# EAGLE design MA1 (EAGLE 9.4.2)
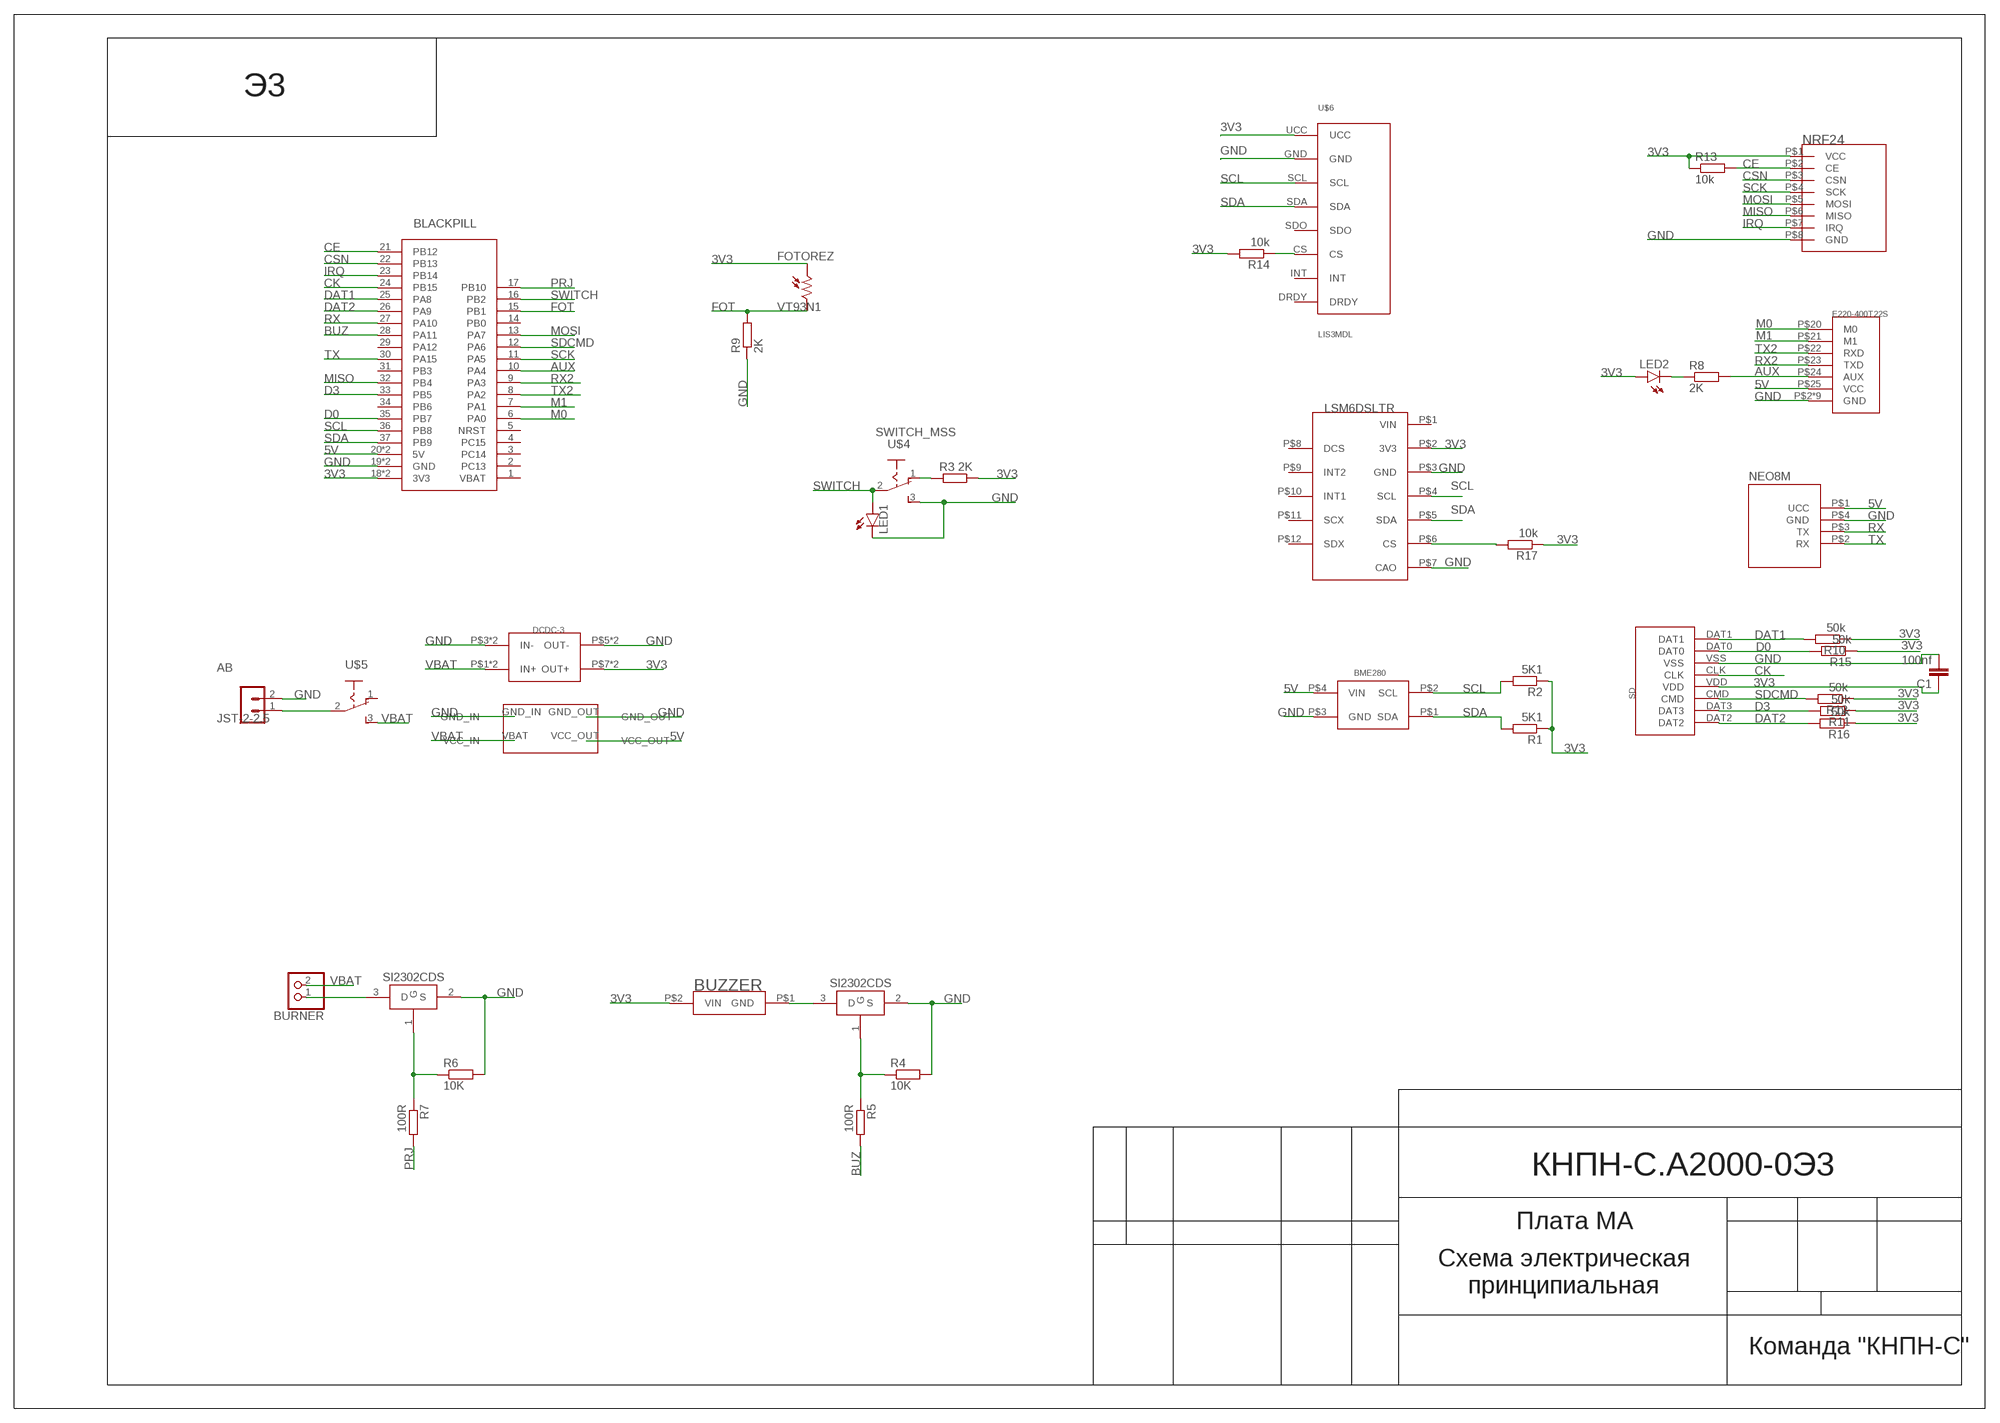
[diagram p0: schematic, sheet 1]

## Parts
AB  JST-2-2.5  [JST-2-2.5]
BLACKPILL  STM32F411_BOARD  [STM32F411_BOARD]
BME280  BME280  [BME280]
BURNER  PINHD-1X2  [1X02]
BUZZER  BUZZERS8R6  [BUZZER-S8R12]
C1  100nf  C-EUC0603  [C0603]
DCDC-3  MP1584-B  [MP1584-B]
E220-400T22S  E220-400T22S  [E220-400T22S]
FOTOREZ  VT93N1  [VT93N1]
LED1  LEDCHIP-LED0603  [CHIP-LED0603]
LED2  LEDCHIP-LED0603  [CHIP-LED0603]
LSM6DSLTR  LSM6DS3-GY  [LSM6DS3-GY]
NEO8M  GPS-NEO7M  [GPS-NEO7M]
NRF24  NRF24L01_ML01SP4  [NRF24L01_ML01SP4]
R1  5K1  R-EU_R0603  [R0603]
R2  5K1  R-EU_R0603  [R0603]
R3  2K  R-EU_R0603  [R0603]
R4  10K  R-EU_R0603  [R0603]
R5  100R  R-EU_R0603  [R0603]
R6  10K  R-EU_R0603  [R0603]
R7  100R  R-EU_R0603  [R0603]
R8  2K  R-EU_R0603  [R0603]
R9  2K  R-EU_R0603  [R0603]
R10  50k  R-EU_R0603  [R0603]
R11  50k  R-EU_R0603  [R0603]
R12  50k  R-EU_R0603  [R0603]
R13  10k  R-EU_R0603  [R0603]
R14  10k  R-EU_R0603  [R0603]
R15  50k  R-EU_R0603  [R0603]
R16  50k  R-EU_R0603  [R0603]
R17  10k  R-EU_R0603  [R0603]
SD  SD  [SD]
U$1  DS-DS_5V  [DS-DS_5V]
U$2  SI2302CDS  [SOT23-3]
U$3  SI2302CDS  [SOT23-3]
U$4  SWITCH_MSS  [SWITCH_MSS]
U$5  UNICS-SWITCHSS_12D11  [SS_12D11]
U$6  LIS3MDL  [LIS3MDL]

## Nets
3V3: BLACKPILL.18(3V3) BLACKPILL.40(3V3) BUZZER.P$2(VIN) C1.1 DCDC-3.P$7(OUT+) DCDC-3.P$8(OUT+) FOTOREZ.P$1 LED2.A LSM6DSLTR.P$2(3V3) NRF24.P$1(VCC) R1.1 R2.1 R3.1 R10.1 R11.1 R12.1 R13.1 R14.2 R15.1 R16.1 R17.1 SD.VDD U$6.UCC
5V: BLACKPILL.20(5V) BLACKPILL.38(5V) BME280.P$4(VIN) E220-400T22S.P$25(VCC) NEO8M.P$1(UCC) U$1.VCC_OUT
AUX: BLACKPILL.10(PA4) E220-400T22S.P$24(AUX) R8.2
BUZ: BLACKPILL.28(PA11) R5.2
CE: BLACKPILL.21(PB12) NRF24.P$2(CE) R13.2
CK: BLACKPILL.24(PB15) SD.CLK
CSN: BLACKPILL.22(PB13) NRF24.P$3(CSN)
D0: BLACKPILL.35(PB7) R15.2 SD.DAT0
D3: BLACKPILL.33(PB5) R11.2 SD.DAT3
DAT1: BLACKPILL.25(PA8) R10.2 SD.DAT1
DAT2: BLACKPILL.26(PA9) R16.2 SD.DAT2
FOT: BLACKPILL.15(PB1) FOTOREZ.P$2 R9.2
GND: AB.2 BLACKPILL.19(GND) BLACKPILL.39(GND) BME280.P$3(GND) C1.2 DCDC-3.P$3(IN-) DCDC-3.P$4(IN-) DCDC-3.P$5(OUT-) DCDC-3.P$6(OUT-) E220-400T22S.P$2(GND) E220-400T22S.P$8(GND) E220-400T22S.P$11(GND) E220-400T22S.P$13(GND) E220-400T22S.P$14(GND) E220-400T22S.P$15(GND) E220-400T22S.P$16(GND) E220-400T22S.P$19(GND) E220-400T22S.P$26(GND) LED1.C LSM6DSLTR.P$3(GND) LSM6DSLTR.P$7(CAO) NEO8M.P$4(GND) NRF24.P$8(GND) R4.2 R6.2 R9.1 SD.VSS U$1.GND_IN U$1.GND_OUT U$2.2(S) U$3.2(S) U$4.3(S) U$6.GND
IRQ: BLACKPILL.23(PB14) NRF24.P$7(IRQ)
M0: BLACKPILL.6(PA0) E220-400T22S.P$20(M0)
M1: BLACKPILL.7(PA1) E220-400T22S.P$21(M1)
MISO: BLACKPILL.32(PB4) NRF24.P$6(MISO)
MOSI: BLACKPILL.13(PA7) NRF24.P$5(MOSI)
N$1: BUZZER.P$1(GND) U$2.3(D)
N$2: BURNER.1 U$3.3(D)
N$3: R6.1 R7.1 U$3.1(G)
N$4: R4.1 R5.1 U$2.1(G)
N$5: AB.1 U$5.2(P)
N$6: R3.2 U$4.1(O)
N$7: LED2.C R8.1
N$8: LSM6DSLTR.P$6(CS) R17.2
N$12: R14.1 U$6.CS
PRJ: BLACKPILL.17(PB10) R7.2
RX: BLACKPILL.27(PA10) NEO8M.P$3(TX)
RX2: BLACKPILL.9(PA3) E220-400T22S.P$23(TXD)
SCK: BLACKPILL.11(PA5) NRF24.P$4(SCK)
SCL: BLACKPILL.36(PB8) BME280.P$2(SCL) LSM6DSLTR.P$4(SCL) R2.2 U$6.SCL
SDA: BLACKPILL.37(PB9) BME280.P$1(SDA) LSM6DSLTR.P$5(SDA) R1.2 U$6.SDA
SDCMD: BLACKPILL.12(PA6) R12.2 SD.CMD
SWITCH: BLACKPILL.16(PB2) LED1.A U$4.2(P)
TX: BLACKPILL.30(PA15) NEO8M.P$2(RX)
TX2: BLACKPILL.8(PA2) E220-400T22S.P$22(RXD)
VBAT: BURNER.2 DCDC-3.P$1(IN+) DCDC-3.P$2(IN+) U$1.VBAT(VCC_IN) U$5.3(S)
Unconnected: BLACKPILL.1(VBAT) BLACKPILL.2(PC13) BLACKPILL.3(PC14) BLACKPILL.4(PC15) BLACKPILL.5(NRST) BLACKPILL.14(PB0) BLACKPILL.29(PA12) BLACKPILL.31(PB3) BLACKPILL.34(PB6) LSM6DSLTR.P$1(VIN) LSM6DSLTR.P$8(DCS) LSM6DSLTR.P$9(INT2) LSM6DSLTR.P$10(INT1) LSM6DSLTR.P$11(SCX) LSM6DSLTR.P$12(SDX) U$5.1(O) U$6.DRDY U$6.INT U$6.SDO

## Notes on the sheet
- Э3
- КНПН-С.А2000-0Э3
- Плата МА
- Схема электрическая
  принципиальная
- Команда "КНПН-С"

## Library data of the parts
AB = UNKNOWN-2024:JST-2-2.5: JST PH series header 2.00mm pitch disconnectable crimp style connectors, vertical (side entry type), 2 pins
BLACKPILL = MA:STM32F411_BOARD
BME280 = MA:BME280
BURNER = pinhead:PINHD-1X2: PIN HEADER
BUZZER = MA:BUZZER
C1 = rcl:C-EU: CAPACITOR, European symbol; SPICEPREFIX: C
DCDC-3 = UNKNOWN-2024:MP1584-B
E220-400T22S = UNKNOWN-2024:E220-400T22S
FOTOREZ = UNKNOWN-2024:VT93N1
LED1 LED2 = led:LED: LED OSRAM: - CHIPLED LG R971, LG N971, LY N971, LG Q971, LY Q971, LO R971, LY R971 LH N974, LH R974 LS Q976, LO Q976, LY Q976 LO Q996 - Hyper CHIPLED LW Q18S LB Q993, LB Q99A, LB R99A - SideLED LS A670, LO A670, LY A670, LG A670, LP A670 LB A673, LV A673, LT A673, LW A673 LH A674 LY A675 LS A676, LA A676, LO A676, LY A676, LW A676 LS A679, LY A679, LG A679 - Hyper Micro SIDELED® LS Y876, LA Y876, LO Y876, LY Y876 LT Y87S - SmartLED LW L88C, LW L88S LB L89C, LB L89S, LG L890 LS L89K, LO L89K, LY L89K LS L896, LA L896, LO L896, LY L896 - TOPLED LS T670, LO T670, LY T670, LG T670, LP T670 LSG T670, LSP T670, LSY T670, LOP T670, LYG T670 LG T671, LOG T671, LSG T671 LB T673, LV T673, LT T673, LW T673 LH T674 LS T676, LA T676, LO T676, LY T676, LB T676, LH T676, LSB T676, LW T676 LB T67C, LV T67C, LT T67C, LS T67K, LO T67K, LY T67K, LW E67C LS E67B, LA E67B, LO E67B, LY E67B, LB E67C, LV E67C, LT E67C LW T67C LS T679, LY T679, LG T679 LS T770, LO T770, LY T770, LG T770, LP T770 LB T773, LV T773, LT T773, LW T773 LH T774 LS E675, LA E675, LY E675, LS T675 LS T776, LA T776, LO T776, LY T776, LB T776 LHGB T686 LT T68C, LB T68C - Hyper Mini TOPLED® LB M676 - Mini TOPLED Santana® LG M470 LS M47K, LO M47K, LY M47K Source: http://www.osram.convergy.de LUXEON: - LUMILED® LXK2-PW12-R00, LXK2-PW12-S00, LXK2-PW14-U00, LXK2-PW14-V00 LXK2-PM12-R00, LXK2-PM12-S00, LXK2-PM14-U00 LXK2-PE12-Q00, LXK2-PE12-R00, LXK2-PE12-S00, LXK2-PE14-T00, LXK2-PE14-U00 LXK2-PB12-K00, LXK2-PB12-L00, LXK2-PB12-M00, LXK2-PB14-N00, LXK2-PB14-P00, LXK2-PB14-Q00 LXK2-PR12-L00, LXK2-PR12-M00, LXK2-PR14-Q00, LXK2-PR14-R00 LXK2-PD12-Q00, LXK2-PD12-R00, LXK2-PD12-S00 LXK2-PH12-R00, LXK2-PH12-S00 LXK2-PL12-P00, LXK2-PL12-Q00, LXK2-PL12-R00 Source: www.luxeon.com KINGBRIGHT: KA-3528ASYC Source: www.kingbright.com
LSM6DSLTR = MA:LSM6DS3-GY
NEO8M = MA:GPS-NEO7M
NRF24 = UNKNOWN-2024:NRF24L01_ML01SP4
R1-R17 = rcl:R-EU_: RESISTOR, European symbol; SPICEPREFIX: R
SD = UNKNOWN-2024:SD
U$1 = MA:DS-DS_5V
U$2 U$3 = CanCubeSat:SI2302CDS
U$4 = UNKNOWN-2024:SWITCH_MSS
U$5 = UNKNOWN-2024:UNICS-SWITCH: SLIDING SWITCH Distributor Buerklin, 11G810
U$6 = UNKNOWN-2024:LIS3MDL

## Board
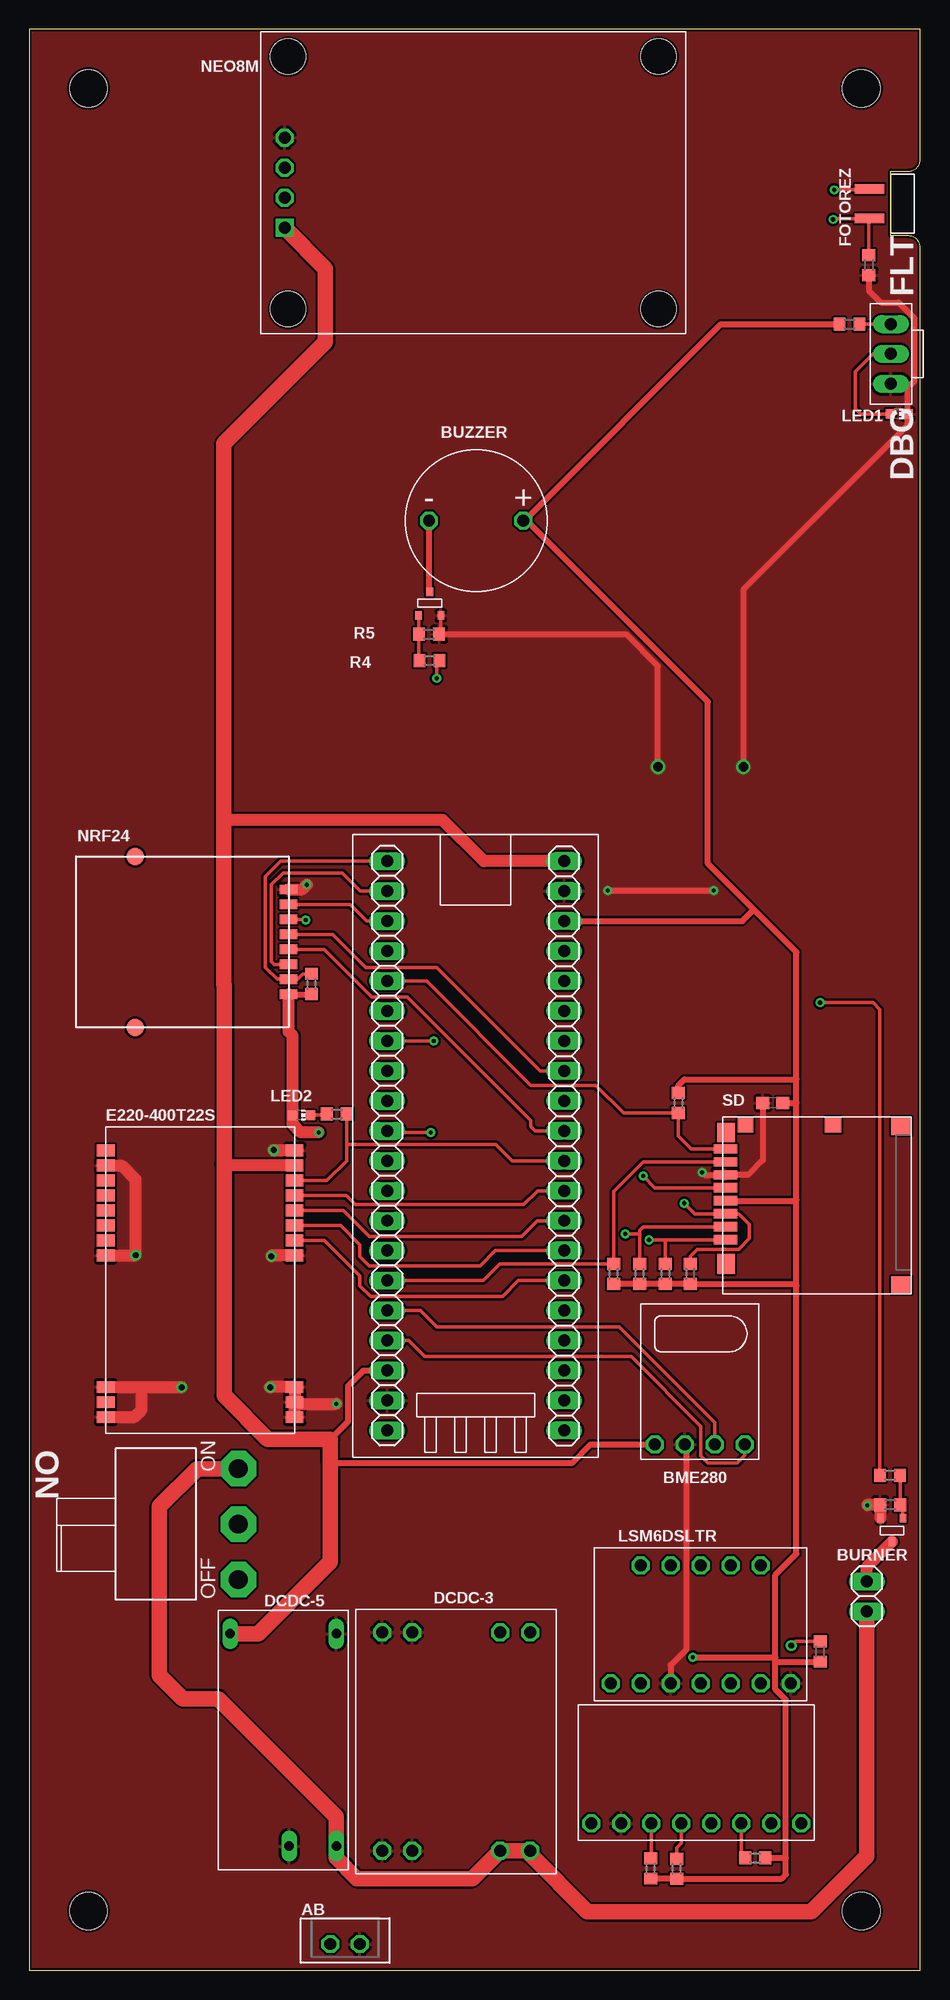
[diagram p1: board, top side]
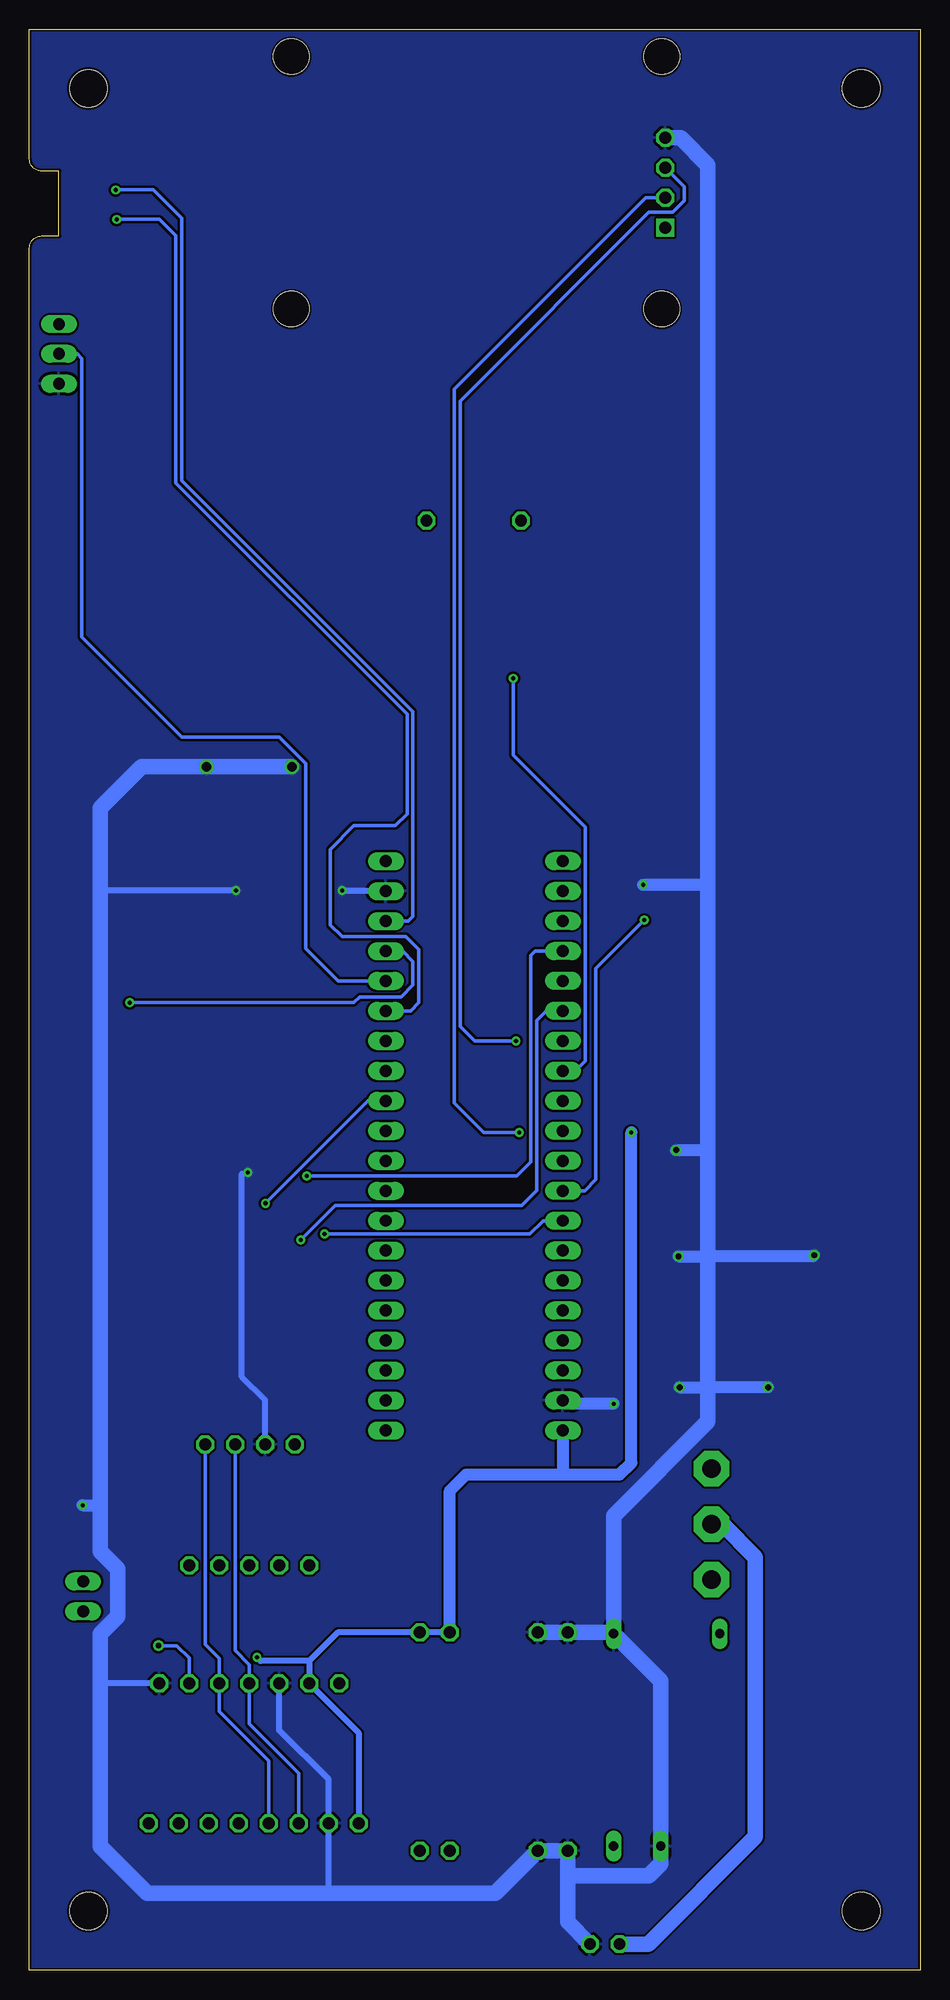
[diagram p2: board, bottom side, seen from below]

Size 75.5 x 164.5 mm. Coordinates in mm from the lower left corner, seen from the top.
Outline: 0,0 75.5,0 75.5,146 arc90 74.5,147 73,147 73,152.5 74.5,152.5 arc90 75.5,153.5 75.5,164.5 0,164.5 0,0
Copper layers (1*16): Top 0.035mm / dielectric 1.5mm / Bottom 0.035mm
Design rules "default *": minimum track width 6mil, minimum drill 0.35mm, track to track 0.2mm, track to pad 0.2mm, pad to pad 0.2mm, via to via 0.2mm, smd to smd 0.2mm, copper to edge 0.2mm, drill to drill 0.2mm, minimum pad ring 10mil, minimum via ring 8mil, stop-mask expansion 4mil, vias tented up to drill 0mil, thermal gap 10mil
Holes 3.2 mm at 70.5,159.5 5,159.5 5,5 70.5,5

### Footprints (pad centres in the part's own frame; a part is rotated, then mirrored left to right if it is on the bottom)
JST-2-2.5 = drill 1 pad 1.5 octagon: 1 1.25,0; 2 -1.25,0
STM32F411_BOARD = drill 1.016 long: 1 24.13,7.5; 2 21.59,7.5; 3 19.05,7.5; 4 16.51,7.5; 5 13.97,7.5; 6 11.43,7.5; 7 8.89,7.5; 8 6.35,7.5; 9 3.81,7.5; 10 1.27,7.5; 11 -1.27,7.5; 12 -3.81,7.5; 13 -6.35,7.5; 14 -8.89,7.5; 15 -11.43,7.5; 16 -13.97,7.5; 17 -16.51,7.5; 18 -19.05,7.5; 19 -21.59,7.5; 20 -24.13,7.5; 21 -24.13,-7.5; 22 -21.59,-7.5; 23 -19.05,-7.5; 24 -16.51,-7.5; 25 -13.97,-7.5; 26 -11.43,-7.5; 27 -8.89,-7.5; 28 -6.35,-7.5; 29 -3.81,-7.5; 30 -1.27,-7.5; 31 1.27,-7.5; 32 3.81,-7.5; 33 6.35,-7.5; 34 8.89,-7.5; 35 11.43,-7.5; 36 13.97,-7.5; 37 16.51,-7.5; 38 19.05,-7.5; 39 21.59,-7.5; 40 24.13,-7.5
BME280 = drill 1.016 octagon: P$1 -3.81,5.33; P$2 -1.27,5.33; P$3 1.27,5.33; P$4 3.81,5.33
1X02 = drill 1.016 long: 1 -1.27,0; 2 1.27,0
BUZZER-S8R12 = drill 1 octagon: P$1 -4,0; P$2 4,0
C0603 = smd 1.1 x 1: 1 -0.85,0; 2 0.85,0
MP1584-B = drill 1.016 octagon: P$1 -9.25,-6.27; P$2 -9.25,-3.73; P$3 -9.25,3.73; P$4 -9.25,6.27; P$5 9.25,6.27; P$6 9.25,3.73; P$7 9.25,-3.73; P$8 9.25,-6.27
E220-400T22S = smd 1.5 x 1: P$1 -8,11; P$2 -8,9.73; P$3 -8,8.46; P$4 -8,7.19; P$5 -8,5.92; P$6 -8,4.65; P$7 -8,3.38; P$8 -8,2.11; P$11 -8,-9.06; P$12 -8,-10.33; P$13 -8,-11.6; P$14 8,-11.6; P$15 8,-10.33; P$16 8,-9.06; P$19 8,2.11; P$20 8,3.38; P$21 8,4.65; P$22 8,5.92; P$23 8,7.19; P$24 8,8.46; P$25 8,9.73; P$26 8,11
VT93N1 = smd 0.8 x 2.5: P$1 -1.25,-1.8; P$2 1.25,-1.8
CHIP-LED0603 = smd 0.8 x 0.8: A 0,-0.75; C 0,0.75
LSM6DS3-GY = drill 1.016 octagon: P$1 -7.62,-5; P$2 -5.08,-5; P$3 -2.54,-5; P$4 0,-5; P$5 2.54,-5; P$6 5.08,-5; P$7 7.62,-5; P$8 -5.08,5; P$9 -2.54,5; P$10 0,5; P$11 2.54,5; P$12 5.08,5
GPS-NEO7M = drill 1.016 square: P$1 -3.81,16 | drill 1.016 octagon: P$2 -1.27,16; P$3 1.27,16; P$4 3.81,16 | hole 3: -10.7,15.7; 10.7,15.7; 10.7,-15.7; -10.7,-15.7
NRF24L01_ML01SP4 = smd 1.5 x 0.8: P$1 -9,4.445; P$2 -9,3.175; P$3 -9,1.905; P$4 -9,0.635; P$5 -9,-0.635; P$6 -9,-1.905; P$7 -9,-3.175; P$8 -9,-4.445 | smd 1.5 x 1.5: P$9 4,7.25; P$10 4,-7.25
R0603 = smd 1 x 1.1: 1 -0.85,0; 2 0.85,0
SD = smd 0.8 x 2: CLK 6,-15.77; CMD 8.2,-15.77; DAT0 3.8,-15.77; DAT1 2.7,-15.77; DAT2 10.4,-15.77; DAT3 9.3,-15.77; VDD 7.1,-15.77; VSS 4.9,-15.77 | smd 1.5 x 1.7: P$9 0.75,-0.85; P$13 14.25,-0.85 | smd 1.6 x 1.5: P$10 1.3,-15.7 | smd 1.29 x 1.3: P$11 0.645,-14.05 | smd 1.29 x 1.4: P$12 0.645,-6.65 | smd 1.7 x 1.5: P$14 12.45,-15.7
DS-DS_5V = drill 0.8 long: GND_IN 0,-13; GND_OUT 4,5; VBAT 4,-13; VCC_OUT -5,5
SOT23-3 = smd 0.56 x 0.73: 1 -0.95,-1; 2 0.95,-1; 3 0,1
SWITCH_MSS = drill 1.016 long: 1 -2.54,0; 2 0,0; 3 2.54,0
SS_12D11 = drill 1.6 pad 3 octagon: 1 -4.7,0; 2 0,0; 3 4.7,0
LIS3MDL = drill 1.016 octagon: CS -5.08,-3.81; DRDY -5.08,-8.89; GND -5.08,6.35; INT -5.08,-6.35; SCL -5.08,3.81; SDA -5.08,1.27; SDO -5.08,-1.27; UCC -5.08,8.89

### Placement (x,y rotation side)
AB  26.75,2.2 180 top
BLACKPILL  37.8,69.87 270 top
BME280  56.81,49.87 180 top
BURNER  70.96,31.66 270 top
BUZZER  37.85,122.86 0 top
C1  63,73.5 180 top
DCDC-3  36.15,19.37 90 top
E220-400T22S  14.47,58.47 0 top
FOTOREZ  73,149.75 270 top
LED1  73.7,131.9 270 top
LED2  23.05,72.47 270 top
LSM6DSLTR  56.88,29.3 0 top
NEO8M  37.61,151.5 90 top
NRF24  12.96,87.15 180 top
R1  54.84,8.59 90 top
R2  52.64,8.61 90 top
R3  69.5,139.5 0 top
R4  33.86,113.23 0 top
R5  33.9,111 0 top
R6  72.95,39.44 180 top
R7  72.93,41.94 180 top
R8  26.04,72.56 0 top
R9  71.14,144.53 90 top
R10  55,73.5 270 top
R11  51.7,59 90 top
R12  56,59 90 top
R13  23.9,83.6 90 top
R14  61.5,9.5 0 top
R15  49.5,59 90 top
R16  53.9,59 90 top
R17  67,27 90 top
SD  74.74,72.3 270 top
U$1  22,23.5 0 top
U$2  33.92,115.83 0 top
U$3  73.09,37.3 180 top
U$4  73,137 270 top
U$5  17.7,37.8 90 top
U$6  56.5,17.5 90 top

### Tracks (layer width: path | path; a pad name or v marks a point on that pad's centre or on a via)
3V3  (via drill 0.35)
  Top 0.3: 64.85,58.15 65,58 | 64.9,65.2 65,65.3 | v68.2,150.9 71.1,150.9 FOTOREZ.P$1
  Top 0.5: 61.4,89.9 65,86.3 65,75.5 | 61.4,89.9 57.5,93.8 57.5,107.51 42.15,122.86 BUZZER.P$2 41.96,122.86 58.6,139.5 R3.1 | 65,73.5 65,65.3 65,58 65,35.28 63.21,33.49 63.21,26.5 | 65,73.5 65,75.5 | R2.1 54.82,7.76 R1.1 63.74,7.74 64.1,8.1 64.1,9.5 | 64.85,58.15 R12.1 R16.1 R11.1 R15.1 | 63.21,26.1 63.21,23.79 64.1,22.9 64.1,9.5 | 63.21,26.1 63.21,26.5 | SD.VDD 64.9,65.2 | NRF24.P$1 23.45,82.7 R13.1 | v56.22,26.5 63.21,26.5 | R17.1 66.95,26.1 63.21,26.1 | R14.2 64.1,9.5 | C1.1 65,73.5 | R10.1 55,75 55.5,75.5 65,75.5 | BLACKPILL.18 60.42,88.92 61.4,89.9
  Top 1: v24.5,71 23,71 22.3,71.7 LED2.A 22.3,79.2 21.96,79.54 NRF24.P$1
  Bottom 0.3: BLACKPILL.18 43.38,88.92 43,89.3 43,106.66 62.61,126.27 62.61,148.51 65,150.9 v68.2,150.9
  Bottom 0.5: DCDC-3.P$7 DCDC-3.P$8 49.38,28.62 51.8,26.2 | 51.8,26.2 LSM6DSLTR.P$2 47.61,20.11 U$6.UCC | 51.8,26.2 55.92,26.2 v56.22,26.5
  Bottom 1: DCDC-3.P$7 39.88,40.62 38.5,42 30.3,42 | 30.3,42 25.5,42 24.5,43 v24.5,71 | BLACKPILL.40 30.3,42
5V
  Top 0.5: BME280.P$4 47.54,44.54 46,43 25.5,43 | BLACKPILL.38 28.32,50.82 27,49.5 27,46.5 25.5,45
  Top 1: E220-400T22S.P$25 16.6,68.2 16.5,68.3 | BLACKPILL.20 38.5,94 35,97.5 16.47,97.5
  Top 1.3: U$1.VCC_OUT 19.4,28.5 25.5,34.6 25.5,43 25.5,45 20.2,45 16.5,48.7 16.5,68.3 16.5,83.5 16.47,83.53 16.47,97.5 16.47,129.38 25.08,137.99 25.08,144.22 NEO8M.P$1
AUX
  Top 0.3: E220-400T22S.P$24 25.2,66.93 26.87,68.6 26.9,68.6 26.89,68.61 26.89,70 | 26.89,70 R8.2 | 26.89,70 39.5,70 40.9,68.6 BLACKPILL.10
BUZ  (via drill 0.35)
  Top 0.3: R5.2 34.5,110.75 v34.5,109.5
  Bottom 0.3: v34.5,109.5 34.5,103 28.4,96.9 28.4,77.05 29.23,76.22 BLACKPILL.28
CE
  Top 0.3: BLACKPILL.21 21.3,94 20,92.7 20,85 21,84 21.93,84 NRF24.P$2 22.68,83.97 23.15,84.45 R13.2
CK  (via drill 0.35)
  Top 0.3: SD.CLK 53,66.3 v52,67.3
  Bottom 0.3: v52,67.3 34.2,67.3 33,68.5 33,86 32.62,86.38 BLACKPILL.24
CSN
  Top 0.3: NRF24.P$3 20.75,85.25 20.5,85.5 20.5,92 21.5,93 26.5,93 28.04,91.46 BLACKPILL.22
D0
  Top 0.3: BLACKPILL.35 38.44,58.44 39.85,59.85 R15.2 49.5,66 52,68.5 SD.DAT0
D3  (via drill 0.35)
  Top 0.3: SD.DAT3 52,63 51.7,62.7 51.7,62.4 | R11.2 51.7,62.4 | 51.7,62.4 v50.5,62.4
  Bottom 0.3: v50.5,62.4 33.1,62.4 31.98,63.52 BLACKPILL.33
DAT1
  Top 0.3: SD.DAT1 56.1,69.6 55,70.7 R10.2 50.35,72.65 48,75 42.5,75 33.66,83.84 BLACKPILL.25
DAT2  (via drill 0.35)
  Top 0.3: SD.DAT2 53.9,61.9 | R16.2 53.9,61.9 | 53.9,61.9 v52.5,61.9
  Bottom 0.3: v52.5,61.9 49.6,64.8 33.8,64.8 32.5,66.1 32.5,80.5 31.7,81.3 BLACKPILL.26
FOT  (via drill 0.35)
  Top 0.3: R9.2 71.14,148.44 | 71.14,148.44 FOTOREZ.P$2 | v68.1,148.4 68.14,148.44 71.14,148.44
  Bottom 0.3: BLACKPILL.15 43.2,81.3 42.5,82 42.5,86.5 43.6,87.6 49,87.6 50,88.6 50,95 48,97 44.5,97 43.5,98 43.5,106.45 63.11,126.06 63.11,147.01 64.5,148.4 v68.1,148.4
GND  (via drill 0.35, 0.5, 0.8)
  Top 0.3: U$2.2 34.87,113.4 R4.2
  Top 0.5: R4.2 50.55,113.23 53.26,110.53 v53.26,102 | BME280.P$3 55.64,44.44 55.64,27.14 54.34,25.84 LSM6DSLTR.P$3 | v57,67.6 57.2,67.4 SD.VSS 60.9,67.4 62.15,68.65 C1.2 | v49,91.5 v58,91.5 | v60.5,102 60.5,117 74.45,130.95 LED1.C 74.45,134.35 74.4,134.4 | 74.4,134.4 74.7,134.4 75,134.7 75,140.02 73.66,141.35 72.15,141.35 71.14,142.36 R9.1 | 74.4,134.4 73.06,134.4 U$4.3
  Top 1: E220-400T22S.P$26 20.73,69.47 v20.7,69.5 | E220-400T22S.P$19 20.58,60.58 v20.5,60.5 | E220-400T22S.P$8 8.98,60.58 | 8.98,60.58 v9,60.6 | v20.4,49.4 v20.41,49.41 E220-400T22S.P$16 E220-400T22S.P$15 | E220-400T22S.P$11 9.5,49.41 | 9.5,49.41 v12.89,49.41 v12.9,49.4 | E220-400T22S.P$13 8.87,46.87 9.5,47.5 9.5,49.41 | E220-400T22S.P$2 7.8,68.2 8.98,67.02 8.98,60.58 | E220-400T22S.P$14 E220-400T22S.P$15 | U$3.2 72.14,39.4 R6.2 71.04,39.44 v71,39.4 | E220-400T22S.P$15 22.61,48 v26,48 | NRF24.P$8 23.09,91.59 v23.5,92
  Bottom 0.3: 69.2,24.3 69.5,24
  Bottom 0.5: v57,67.6 57.1,67.5 57.5,67.5 57.5,50.28 55.54,48.32 BME280.P$3 | 50,6.5 50.15,6.65 U$6.GND 50.15,16.15 54.34,20.34 LSM6DSLTR.P$3 | BLACKPILL.19 48.96,91.46 v49,91.5 | v58,91.5 69.5,91.5 | LSM6DSLTR.P$7 69.2,24.3
  Bottom 1: v20.7,69.5 18,69.5 | v20.5,60.5 18,60.5 9.1,60.5 v9,60.6 | v71,39.4 69.5,39.4 | v26,48 30.02,48 BLACKPILL.39 | v23.5,92 18,92 | v12.9,49.4 17.9,49.4 | 17.9,49.4 18,49.5 | v20.4,49.4 17.9,49.4
  Bottom 1.3: NEO8M.P$4 20.31,155.31 18,153 18,92 18,69.5 18,60.5 18,49.5 18,46.5 26,38.5 U$1.GND_OUT | U$1.GND_OUT 22,24.5 U$1.GND_IN 22,9 23,8 29.88,8 | DCDC-3.P$6 DCDC-3.P$5 26.12,28.62 U$1.GND_OUT | v53.26,102 v60.5,102 66,102 69.5,98.5 69.5,91.5 69.5,39.4 69.5,35.5 68,34 68,30 69.5,28.5 69.5,24 69.5,10.5 65.5,6.5 50,6.5 36.04,6.5 DCDC-3.P$3 DCDC-3.P$4 29.88,8 | 29.88,8 29.88,4.08 AB.2
  pour Bottom: -1,165.5 -1,-0.5 77,-0.5 77,165.5
  pour Top: -0.5,165.5 -0.5,-0.5 77,-0.5 77,165.5
IRQ
  Top 0.3: NRF24.P$7 27.18,90.33 28.58,88.92 BLACKPILL.23
M0
  Top 0.3: E220-400T22S.P$20 25,61.85 28,58.85 28,58 28.9,57.1 40.1,57.1 41.44,58.44 BLACKPILL.6
M1
  Top 0.3: E220-400T22S.P$21 26.36,63.12 28,61.48 28,60.5 28.8,59.7 38.2,59.7 39.48,60.98 BLACKPILL.7
MISO  (via drill 0.35)
  Top 0.3: NRF24.P$6 23.34,89.06 v23.4,89
  Bottom 0.3: v23.4,89 27.5,84.9 27.5,67 28.44,66.06 BLACKPILL.32
MOSI
  Top 0.3: NRF24.P$5 25.71,87.78 28.5,85 34.5,85 43.28,76.22 BLACKPILL.13
N$1
  Top 0.5: BUZZER.P$1 33.85,116.9 U$2.3
N$2
  Top 1: BURNER.1 70.96,34.17 U$3.3
N$3
  Top 0.3: U$3.1 74,38.33 74,39.24 R6.1 73.8,41.92 R7.1
N$4
  Top 0.3: U$2.1 33.01,114.79 R4.1 33.01,111.04 R5.1
N$5
  Bottom 1.3: AB.1 23.08,2.2 14,11.28 14,35 16.8,37.8 U$5.2
N$6
  Top 0.3: R3.2 70.39,139.54 U$4.1
N$7
  Top 0.3: R8.1 25.1,72.47 LED2.C
N$8  (via drill 0.5)
  Top 0.3: R17.2 64.92,27.85 v64.57,27.5
  Bottom 0.3: v64.57,27.5 63,27.5 61.96,26.46 LSM6DSLTR.P$6
N$12
  Top 0.3: R14.1 60.31,9.84 U$6.CS
PRJ  (via drill 0.35)
  Top 0.3: R7.2 72.08,81.42 71.5,82 v67,82
  Bottom 0.3: v67,82 48,82 47.5,82.5 44,82.5 43,83.5 43,85.5 43.88,86.38 BLACKPILL.17
RX  (via drill 0.35)
  Top 0.3: v34.27,78.77 BLACKPILL.27
  Bottom 0.3: NEO8M.P$3 20,151.15 20,150 21,149 23,149 39,133 39,80 37.77,78.77 v34.27,78.77
RX2
  Top 0.3: E220-400T22S.P$23 26.84,65.66 27.6,64.9 41.9,64.9 43.06,66.06 BLACKPILL.9
SCK
  Top 0.3: NRF24.P$4 21.98,86.5 25,86.5 29,82.5 32,82.5 42.5,72 42.5,71.5 42.86,71.14 BLACKPILL.11
SCL
  Top 0.3: BME280.P$2 58.08,46.42 50,54.5 34.5,54.5 33.1,55.9 BLACKPILL.36 | U$6.SCL 52.69,9.51 R2.2
  Bottom 0.3: BME280.P$2 58.08,27.08 56.88,25.88 LSM6DSLTR.P$4 56.88,20.88 52.69,16.69 U$6.SCL
SDA
  Top 0.3: BME280.P$1 60.62,43.62 60,43 57.5,43 56.9,43.6 56.9,46.1 51,52 33.5,52 32.14,53.36 BLACKPILL.37 | U$6.SDA 55.23,10.73 54.84,10.34 R1.2
  Bottom 0.3: BME280.P$1 60.62,27.62 59.42,26.42 LSM6DSLTR.P$5 59.42,21.92 55.23,17.73 U$6.SDA
SDCMD  (via drill 0.35)
  Top 0.3: R12.2 56,60.5 56.6,61.1 60.1,61.1 61,62 61,63.2 60.1,64.1 SD.CMD 56.4,64.1 v55.5,65
  Bottom 0.3: BLACKPILL.12 46.82,73.68 v55.5,65
SWITCH
  Top 0.3: LED1.A 70.45,131.9 70,132.35 70,135.5 71.5,137 U$4.2
  Bottom 0.3: U$4.2 71.47,137 71.07,136.6 71.07,113.01 62.58,104.52 54.32,104.52 52.08,102.28 52.08,86.58 49.34,83.84 BLACKPILL.16
TX  (via drill 0.35)
  Top 0.3: v34,71 30.44,71 BLACKPILL.30
  Bottom 0.3: NEO8M.P$2 23.27,150.23 39.5,134 39.5,73.5 37,71 v34,71
TX2
  Top 0.3: E220-400T22S.P$22 26.61,64.39 28.8,62.2 41.7,62.2 43.02,63.52 BLACKPILL.8
VBAT
  Top 1.3: BURNER.2 70.96,9.66 66.24,4.94 47.28,4.94 42.42,9.79 DCDC-3.P$1 DCDC-3.P$2 37.51,7.75 27.75,7.75 26,9.5 U$1.VBAT 26,13 16,23 13,23 11,25 11,39.3 14.2,42.5 U$5.3

### Text on the board
tNames: FLT | DBG | ON | DCDC-5
tValues: *4